# Altium schematic sheet Filter.SchDoc
size A3; SheetNumber: 3; SheetTotal: 3
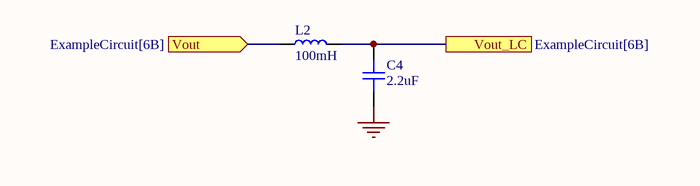
[diagram p0: Filter.SchDoc]

## Parts
C4  2.2uF  [CAP_0603]
L2  100mH  [IND_0603]

## Ports
Vout (in, see ExampleCircuit[6B]), Vout_LC (see ExampleCircuit[6B])

## Nets
GND: C4.2
Vout: L2.1 ; port Vout
Vout_LC: C4.1 L2.2 ; port Vout_LC

## Library data of the parts
C4 = CAP_0603: Capacitor SMD 0603; Manufacturer: *; Manufacturer Part Number: *; Distributor Link: *; LCSC: *; Rating: *; Dielectric: *
L2 = IND_0603: Inductor SMD 0603